# EasyEDA Pro project rk3568_xc7a100t.eprj, schematic rk3568, sheets 7 to 9 of 9

## Sheets
7 rk3568_board_peripheral: Create Date: 2024-08-02
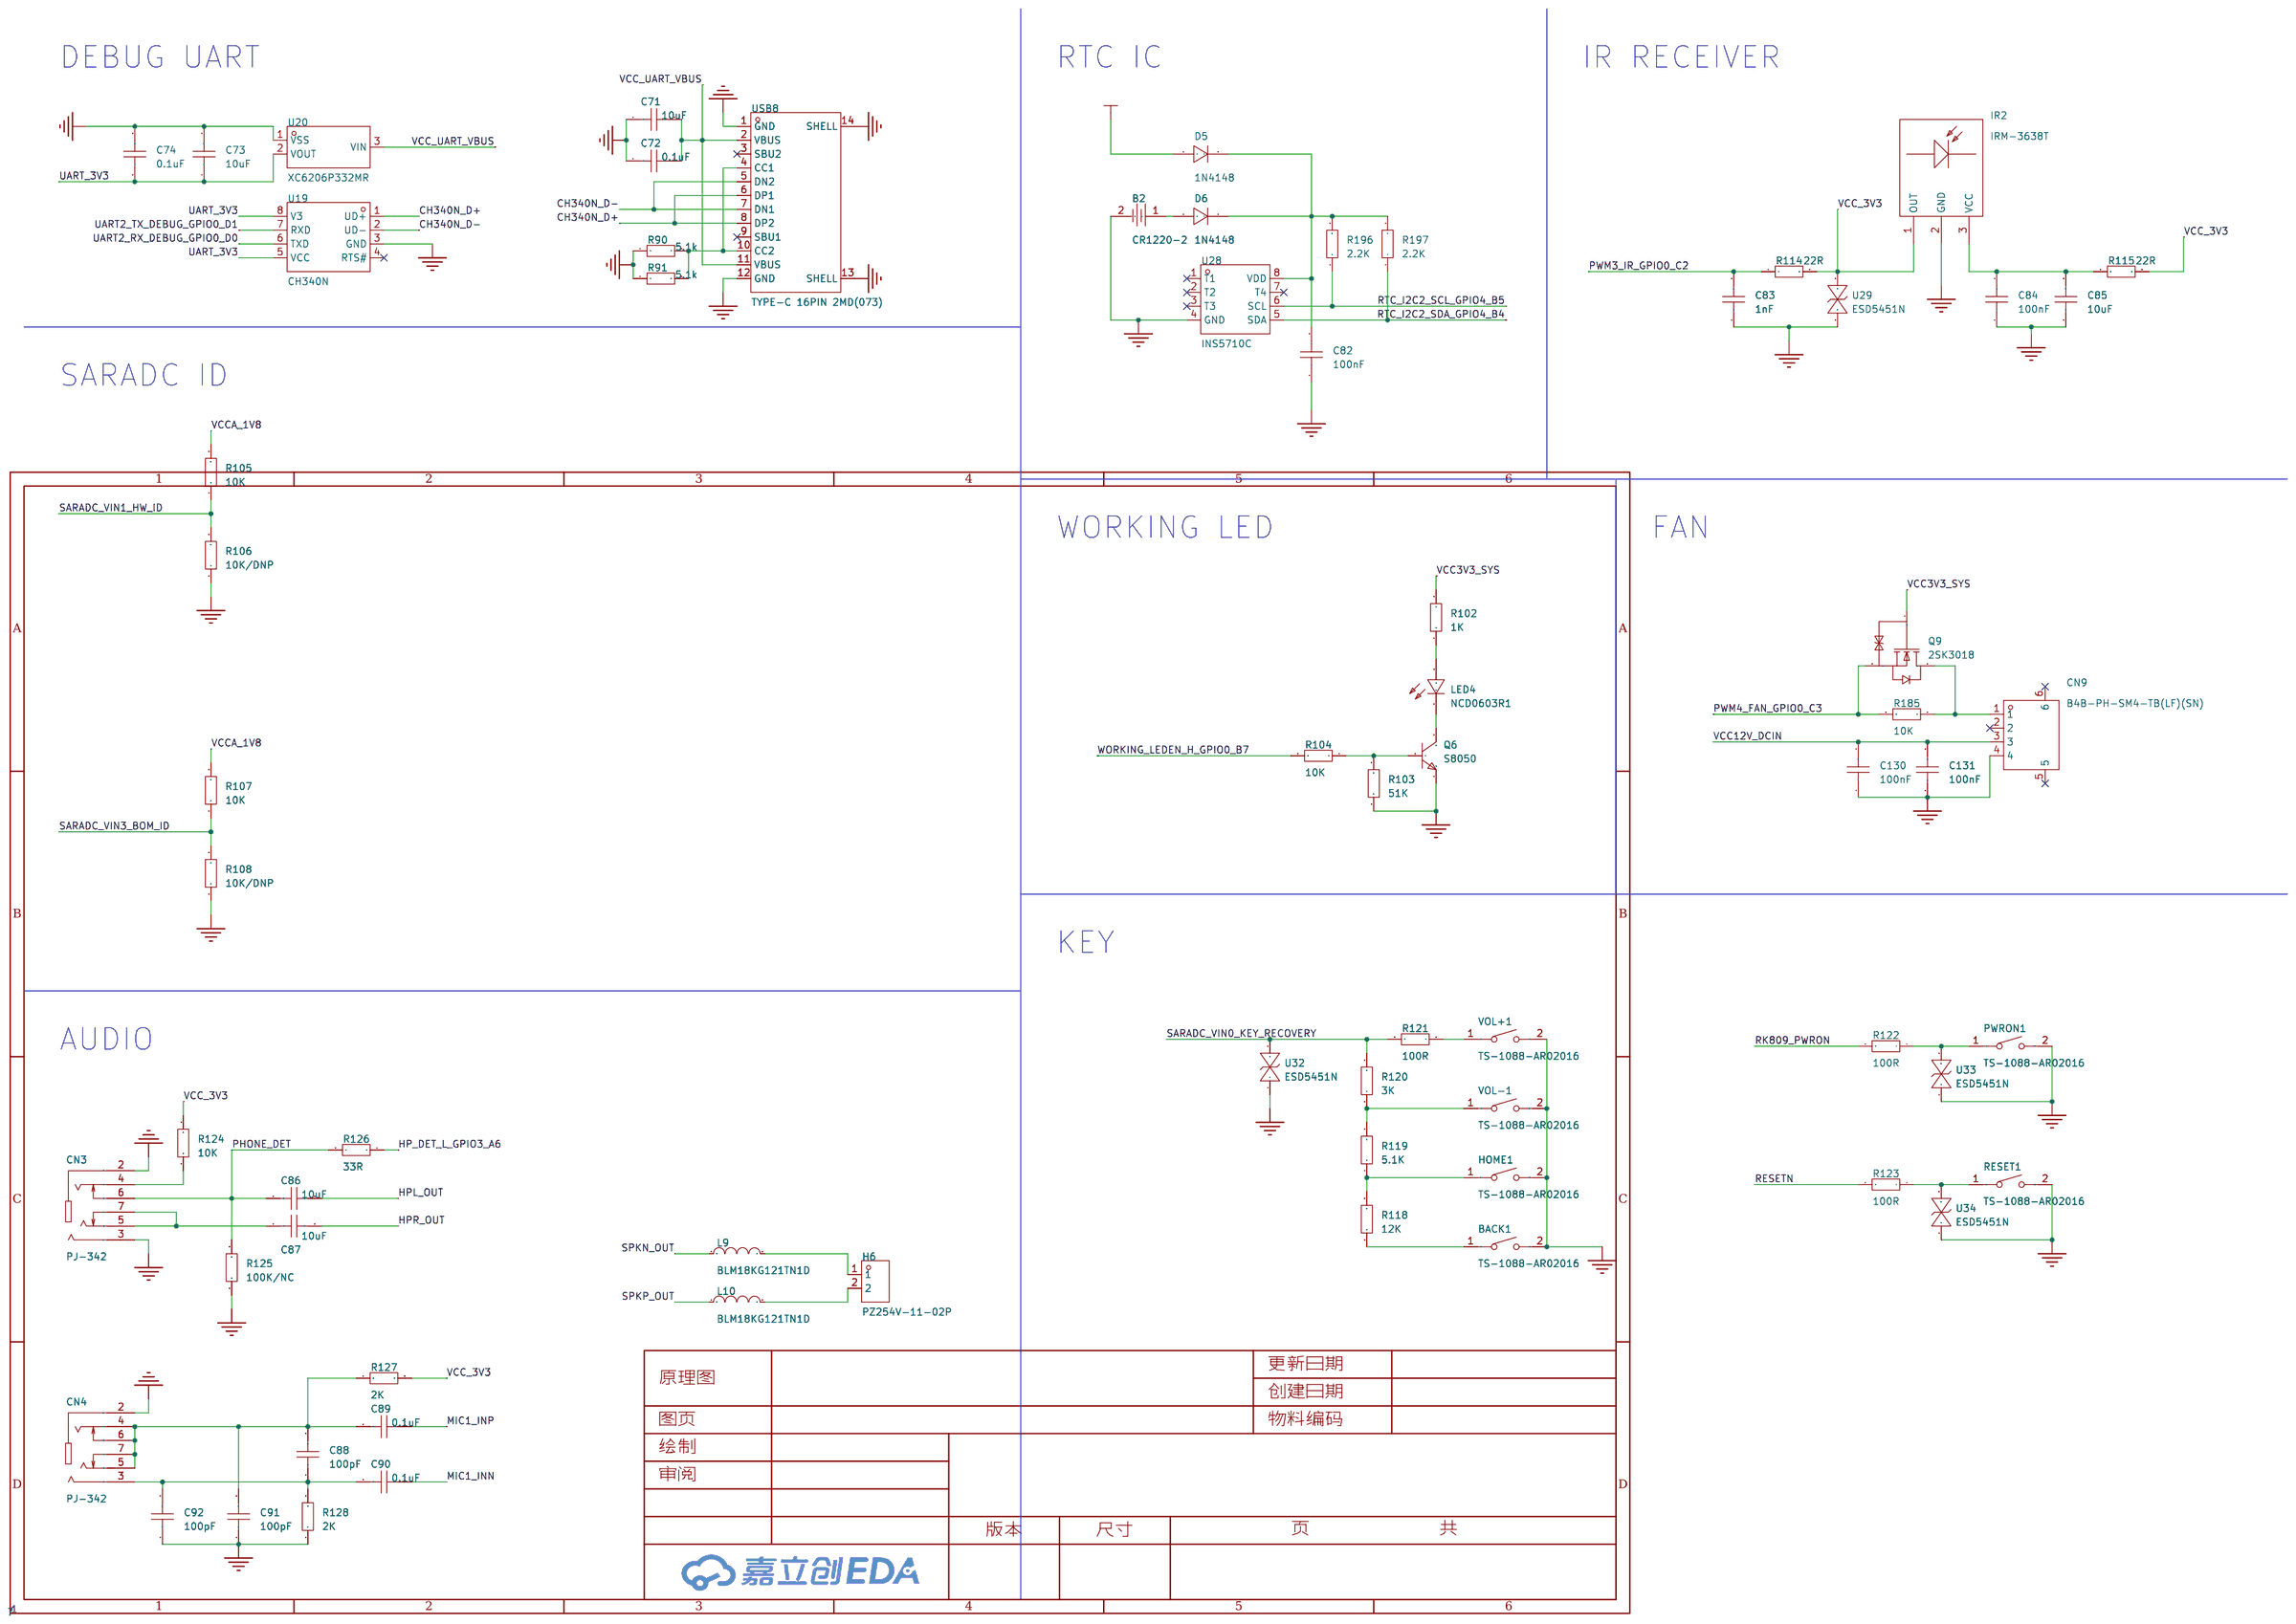
[diagram p6: rk3568_board_peripheral]
8 rk3568_user_interface: Create Date: 2024-08-02
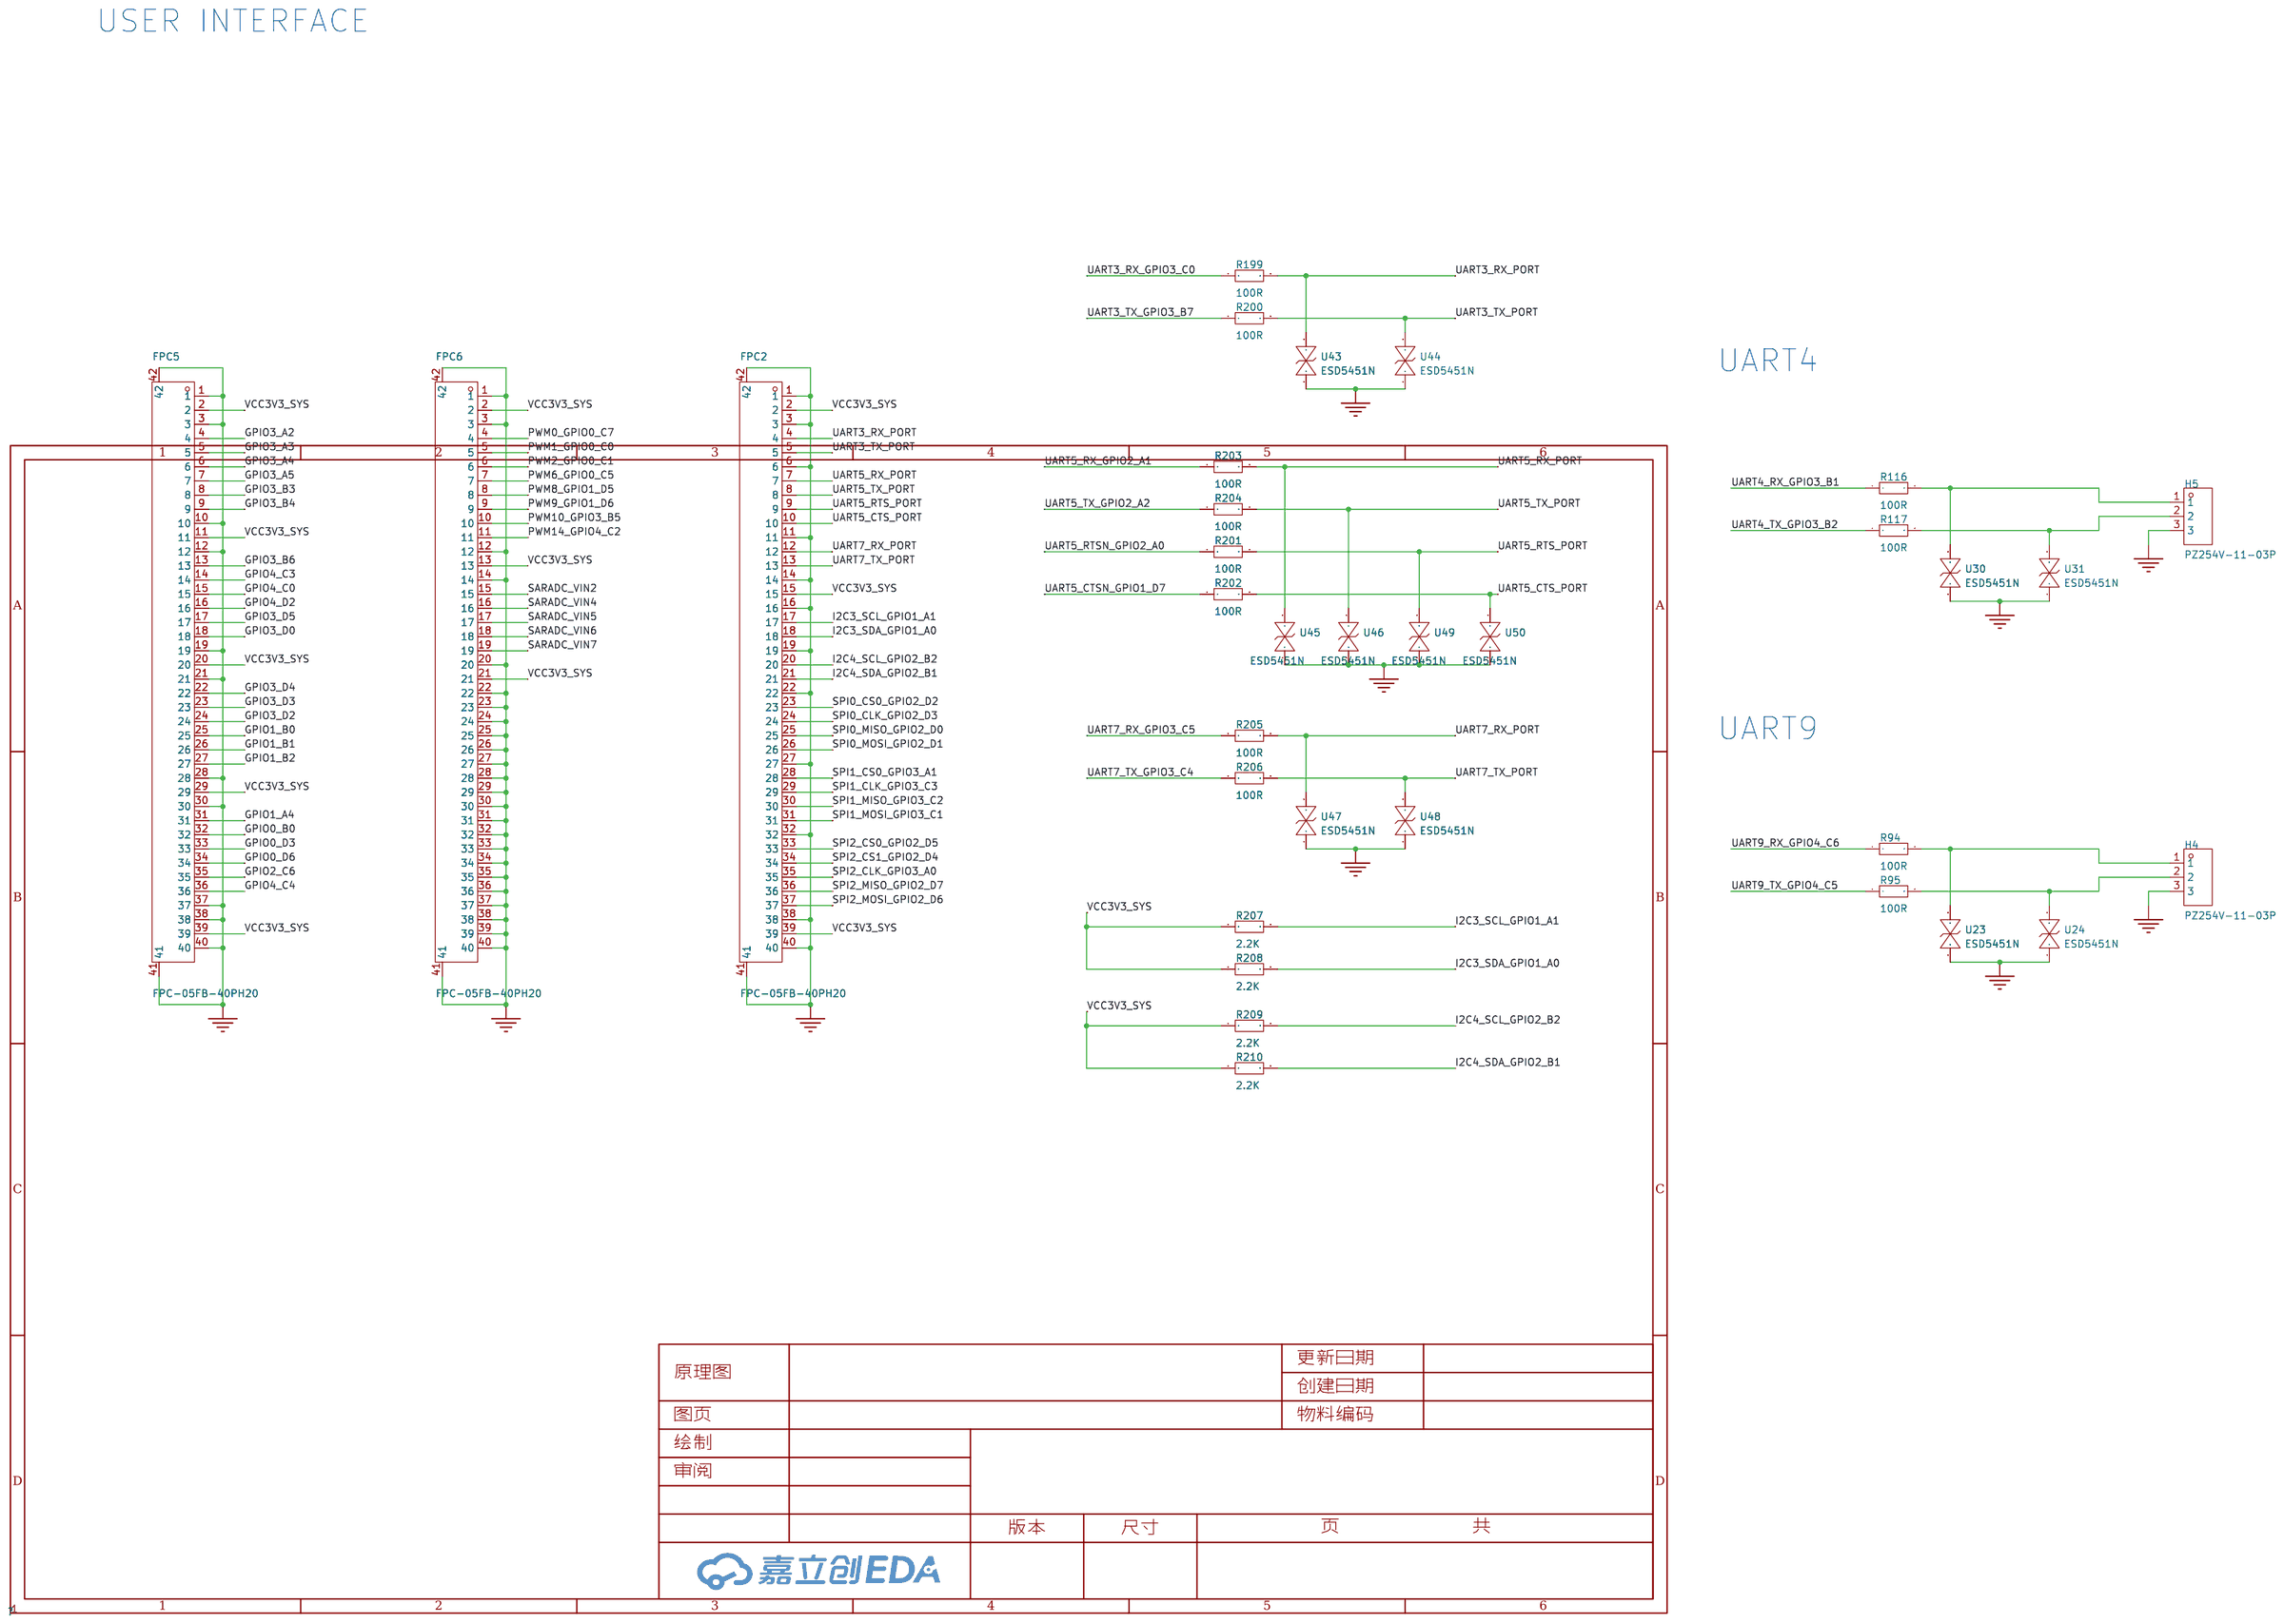
[diagram p7: rk3568_user_interface]
9 rk3568_pcie30x2_m2: Create Date: 2024-08-07
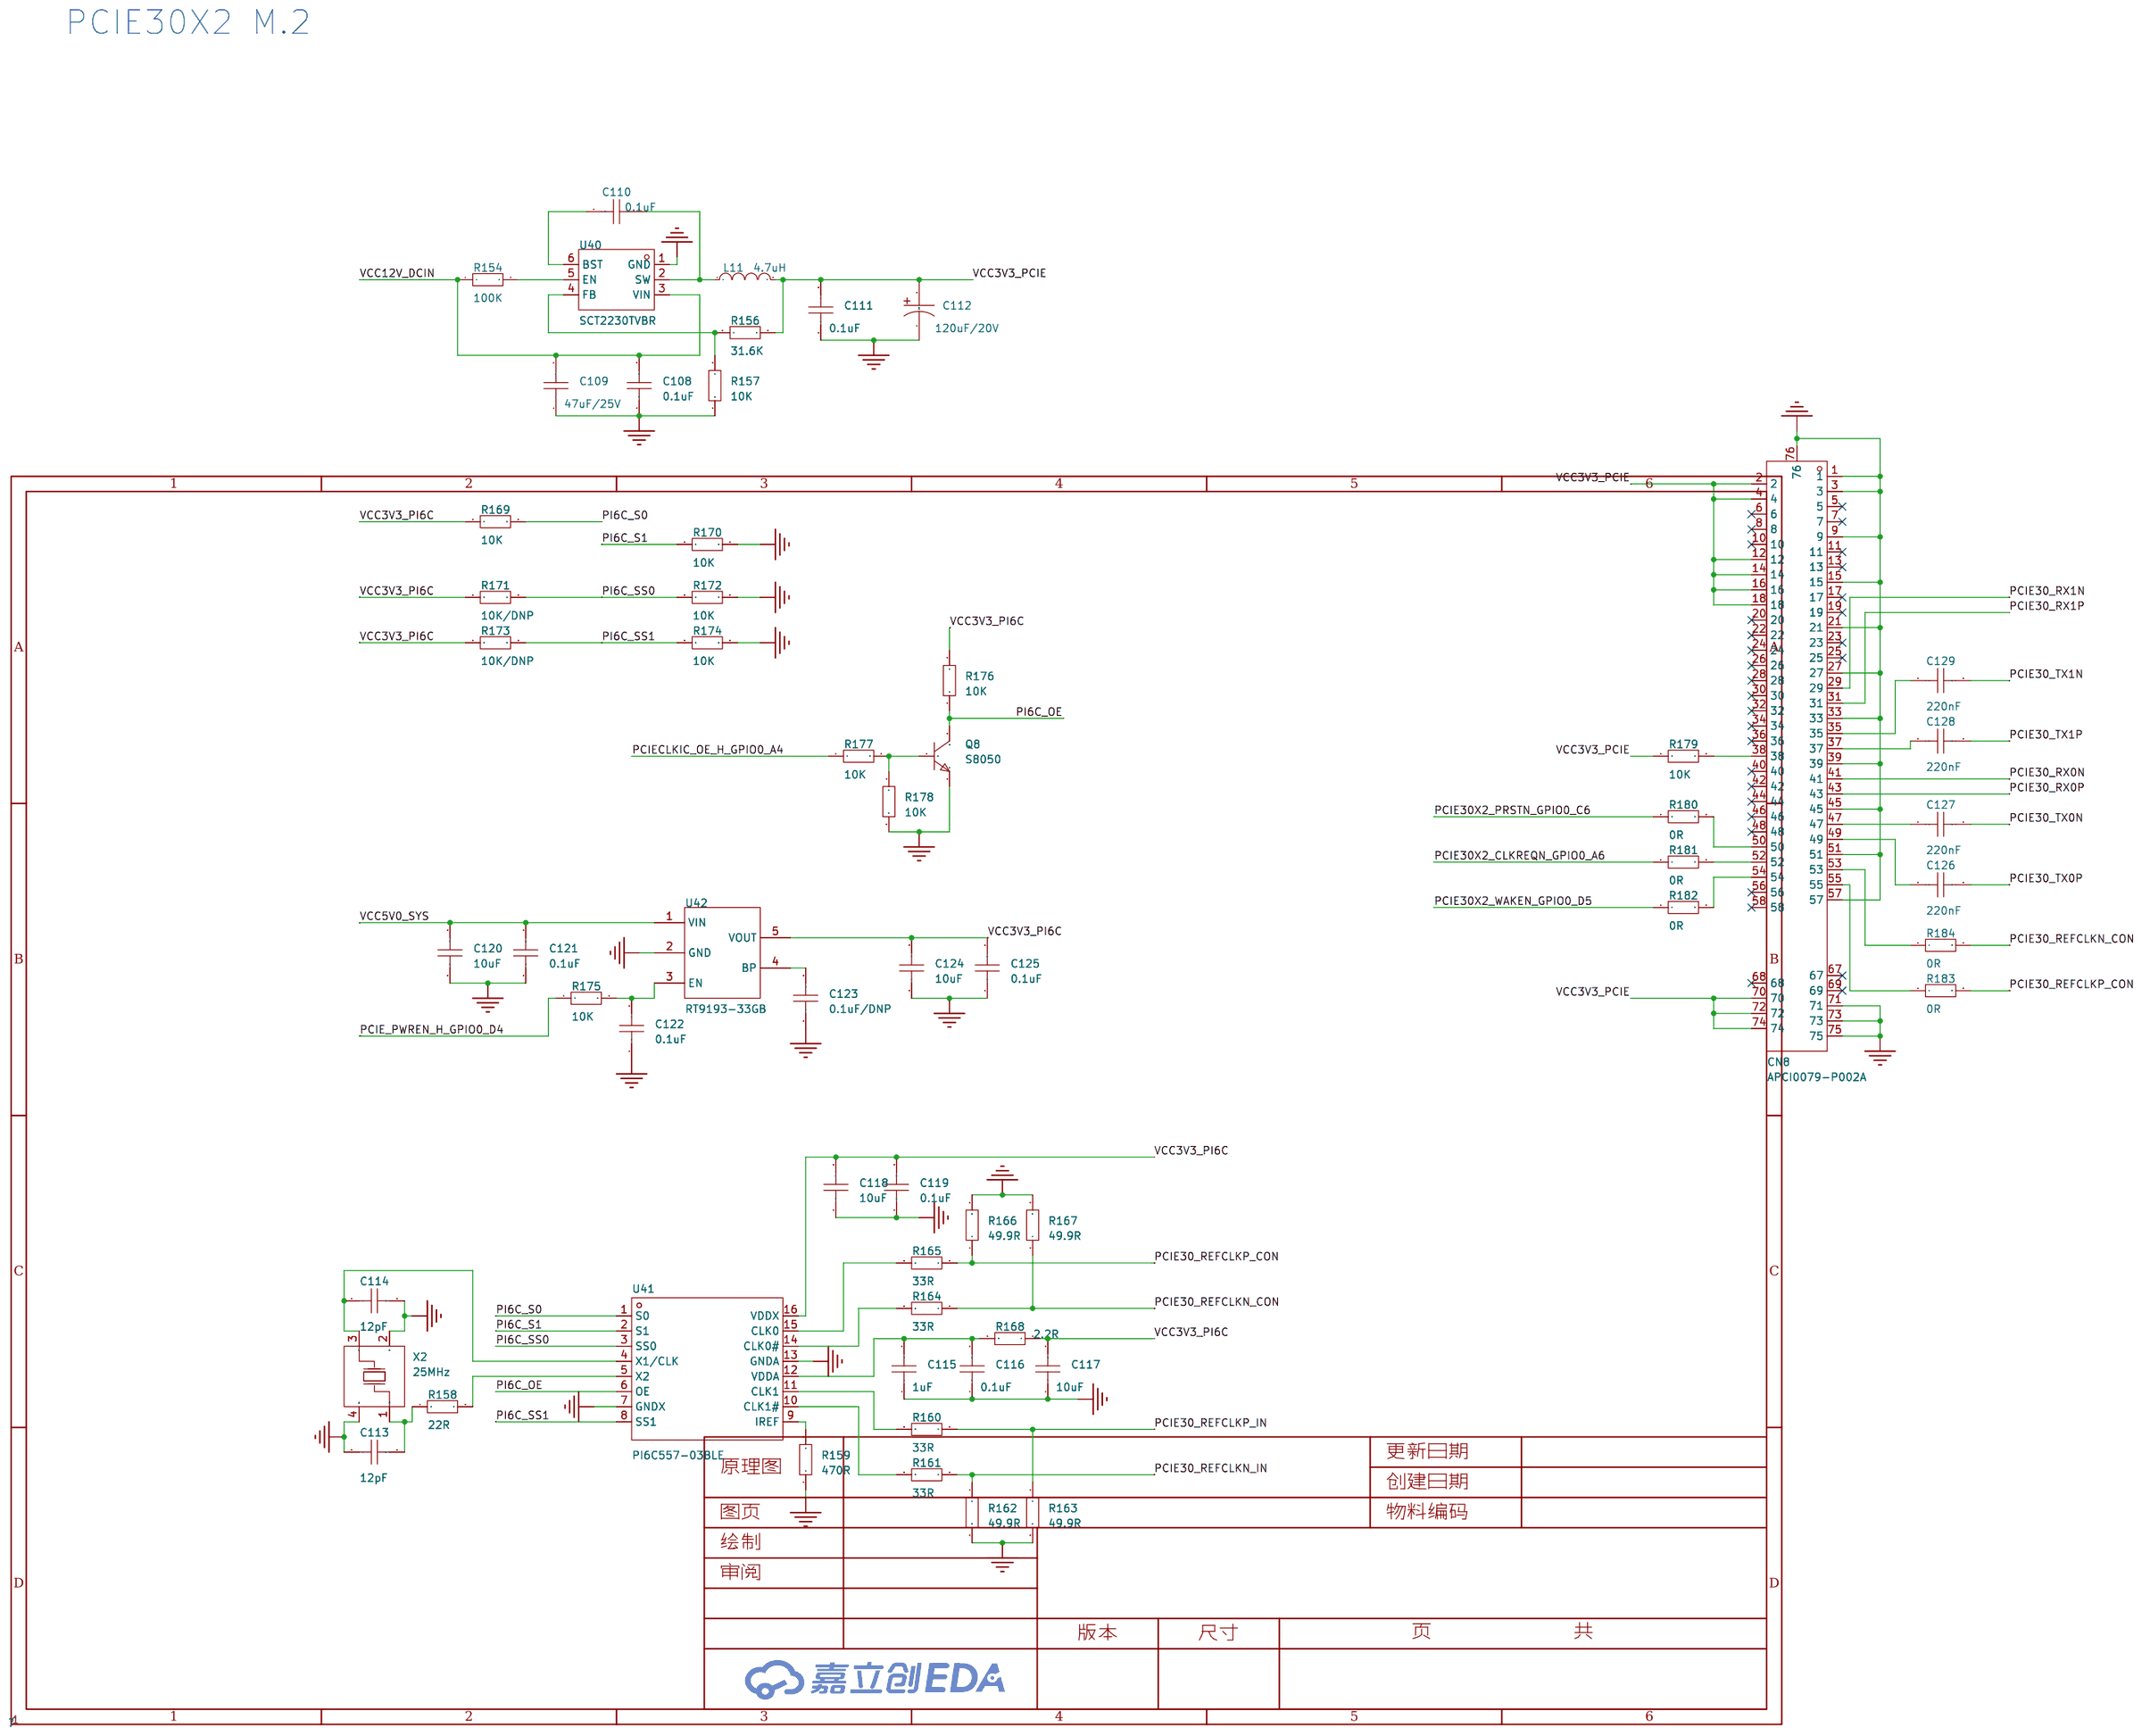
[diagram p8: rk3568_pcie30x2_m2]

## Parts
sheet rk3568_board_peripheral
B2  CR1220-2  [BAT-SMD_CR1220-2]
BACK1  TS-1088-AR02016  [SW-SMD_L3.9-W3.0-P4.45]
C71  10uF  [C0603]
C72  0.1uF  [C0603]
C73  10uF  [C0603]
C74  0.1uF  [C0603]
C82  100nF  [C0603]
C83  1nF  [C0603]
C84  100nF  [C0603]
C85  10uF  [C0603]
C86  10uF  [C0603]
C87  10uF  [C0603]
C88  100pF  [C0603]
C89  0.1uF  [C0603]
C90  0.1uF  [C0603]
C91  100pF  [C0603]
C92  100pF  [C0603]
C130  100nF  [C0603]
C131  100nF  [C0603]
CN3  PJ-342  [AUDIO-SMD_PJ-342]
CN4  PJ-342  [AUDIO-SMD_PJ-342]
CN9  B4B-PH-SM4-TB(LF)(SN)  [CONN-SMD_B4B-PH-SM4-TB-LF-SN]
D5  1N4148  [DO-35_BD2.0-L4.0-P8.00-D0.5-FD]
D6  1N4148  [DO-35_BD2.0-L4.0-P8.00-D0.5-FD]
H6  PZ254V-11-02P  [HDR-TH_2P-P2.54-V-M]
HOME1  TS-1088-AR02016  [SW-SMD_L3.9-W3.0-P4.45]
IR2  IRM-3638T  [OPTO-TH_IRM-3638T]
L9  BLM18KG121TN1D  [L0603]
L10  BLM18KG121TN1D  [L0603]
LED4  NCD0603R1  [LED0603-RD_RED]
PWRON1  TS-1088-AR02016  [SW-SMD_L3.9-W3.0-P4.45]
Q6  S8050  [SOT-23-3_L2.9-W1.6-P1.90-LS2.8-BR]
Q9  2SK3018  [SOT-323-3_L2.0-W1.3-P1.30-LS2.1-BR]
R90  5.1k  [R0603]
R91  5.1k  [R0603]
R102  1K  [R0603]
R103  51K  [R0603]
R104  10K  [R0603]
R105  10K  [R0603]
R106  10K/DNP  [R0603]
R107  10K  [R0603]
R108  10K/DNP  [R0603]
R114  22R  [R0603]
R115  22R  [R0603]
R118  12K  [R0603]
R119  5.1K  [R0603]
R120  3K  [R0603]
R121  100R  [R0603]
R122  100R  [R0603]
R123  100R  [R0603]
R124  10K  [R0603]
R125  100K/NC  [R0603]
R126  33R  [R0603]
R127  2K  [R0603]
R128  2K  [R0603]
R185  10K  [R0603]
R196  2.2K  [R0603]
R197  2.2K  [R0603]
RESET1  TS-1088-AR02016  [SW-SMD_L3.9-W3.0-P4.45]
U19  CH340N  [SOP-8_L4.9-W3.9-P1.27-LS6.0-BL]
U20  XC6206P332MR  [SOT-23-3_L3.0-W1.7-P0.95-LS2.9-BR]
U28  INS5710C  [SOP-8_L4.9-W3.9-P1.27-LS6.0-BL]
U29  ESD5451N  [X1-DFN1006-2_L1.0-W0.6-P0.65-BI]
U32  ESD5451N  [X1-DFN1006-2_L1.0-W0.6-P0.65-BI]
U33  ESD5451N  [X1-DFN1006-2_L1.0-W0.6-P0.65-BI]
U34  ESD5451N  [X1-DFN1006-2_L1.0-W0.6-P0.65-BI]
USB8  TYPE-C 16PIN 2MD(073)  [USB-C-SMD_TYPE-C-6PIN-2MD-073]
VOL+1  TS-1088-AR02016  [SW-SMD_L3.9-W3.0-P4.45]
VOL-1  TS-1088-AR02016  [SW-SMD_L3.9-W3.0-P4.45]
sheet rk3568_pcie30x2_m2
C108  0.1uF  [C0603]
C109  47uF/25V  [C0603]
C110  0.1uF  [C0603]
C111  0.1uF  [C0603]
C112  120uF/20V  [CAP-SMD_BD5.0-L5.3-W5.3-FD]
C113  12pF  [C0603]
C114  12pF  [C0603]
C115  1uF  [C0603]
C116  0.1uF  [C0603]
C117  10uF  [C0603]
C118  10uF  [C0603]
C119  0.1uF  [C0603]
C120  10uF  [C0603]
C121  0.1uF  [C0603]
C122  0.1uF  [C0603]
C123  0.1uF/DNP  [C0603]
C124  10uF  [C0603]
C125  0.1uF  [C0603]
C126  220nF  [C0603]
C127  220nF  [C0603]
C128  220nF  [C0603]
C129  220nF  [C0603]
CN8  APCI0079-P002A  [PCI-SMD_APCI0079-P002A]
L11  4.7uH  [L0603]
Q8  S8050  [SOT-23-3_L2.9-W1.3-P1.90-LS2.4-BR]
R154  100K  [R0603]
R156  31.6K  [R0603]
R157  10K  [R0603]
R158  22R  [R0603]
R159  470R  [R0603]
R160  33R  [R0603]
R161  33R  [R0603]
R162  49.9R  [R0603]
R163  49.9R  [R0603]
R164  33R  [R0603]
R165  33R  [R0603]
R166  49.9R  [R0603]
R167  49.9R  [R0603]
R168  2.2R  [R0603]
R169  10K  [R0603]
R170  10K  [R0603]
R171  10K/DNP  [R0603]
R172  10K  [R0603]
R173  10K/DNP  [R0603]
R174  10K  [R0603]
R175  10K  [R0603]
R176  10K  [R0603]
R177  10K  [R0603]
R178  10K  [R0603]
R179  10K  [R0603]
R180  0R  [R0603]
R181  0R  [R0603]
R182  0R  [R0603]
R183  0R  [R0603]
R184  0R  [R0603]
U40  SCT2230TVBR  [TSOT-23-6_L2.9-W1.6-P0.95-LS2.8-BL]
U41  PI6C557-03BLE  [TSSOP-16_L5.0-W4.4-P0.65-LS6.4-BL]
U42  RT9193-33GB  [SOT-23-5_L3.0-W1.7-P0.95-LS2.8-BL]
X2  25MHz  [OSC-SMD_4P-L3.2-W2.5-BL]
sheet rk3568_user_interface
FPC2  FPC-05FB-40PH20  [FPC-SMD_40P-P0.50_XUNPU_FPC-05FB-40PH20]
FPC5  FPC-05FB-40PH20  [FPC-SMD_40P-P0.50_XUNPU_FPC-05FB-40PH20]
FPC6  FPC-05FB-40PH20  [FPC-SMD_40P-P0.50_XUNPU_FPC-05FB-40PH20]
H4  PZ254V-11-03P  [HDR-TH_3P-P2.54-V-M]
H5  PZ254V-11-03P  [HDR-TH_3P-P2.54-V-M]
R94  100R  [R0603]
R95  100R  [R0603]
R116  100R  [R0603]
R117  100R  [R0603]
R199  100R  [R0603]
R200  100R  [R0603]
R201  100R  [R0603]
R202  100R  [R0603]
R203  100R  [R0603]
R204  100R  [R0603]
R205  100R  [R0603]
R206  100R  [R0603]
R207  2.2K  [R0603]
R208  2.2K  [R0603]
R209  2.2K  [R0603]
R210  2.2K  [R0603]
U23  ESD5451N  [X1-DFN1006-2_L1.0-W0.6-P0.65-BI]
U24  ESD5451N  [X1-DFN1006-2_L1.0-W0.6-P0.65-BI]
U30  ESD5451N  [X1-DFN1006-2_L1.0-W0.6-P0.65-BI]
U31  ESD5451N  [X1-DFN1006-2_L1.0-W0.6-P0.65-BI]
U43  ESD5451N  [X1-DFN1006-2_L1.0-W0.6-P0.65-BI]
U44  ESD5451N  [X1-DFN1006-2_L1.0-W0.6-P0.65-BI]
U45  ESD5451N  [X1-DFN1006-2_L1.0-W0.6-P0.65-BI]
U46  ESD5451N  [X1-DFN1006-2_L1.0-W0.6-P0.65-BI]
U47  ESD5451N  [X1-DFN1006-2_L1.0-W0.6-P0.65-BI]
U48  ESD5451N  [X1-DFN1006-2_L1.0-W0.6-P0.65-BI]
U49  ESD5451N  [X1-DFN1006-2_L1.0-W0.6-P0.65-BI]
U50  ESD5451N  [X1-DFN1006-2_L1.0-W0.6-P0.65-BI]

## Library data of the parts
B2 = CR1220-2: LCSC Part Name: 电池底座 适用电池:CR1220; Supplier Part: C70381; Manufacturer: Q&J; Supplier Footprint: SMD; JLCPCB Part Class: 扩展库; Datasheet: https://atta.szlcsc.com/upload/public/pdf/source/20160427/1461725216696.pdf; Supplier: LCSC; Connector Type: 电池底座; Battery Type: CR1220
BACK1 HOME1 PWRON1 RESET1 VOL+1 VOL-1 = TS-1088-AR02016: LCSC Part Name: 4*3*2mm 立贴 轻触开关; Supplier Part: C720477; Manufacturer: XUNPU(讯普); Supplier Footprint: SMD; JLCPCB Part Class: 扩展库; Datasheet: https://atta.szlcsc.com/upload/public/pdf/source/20200810/C720475_60D09DD6C54279ADDB2DC25100F1CC11.pdf; Supplier: LCSC; Circuit: 单刀单掷; Actuator Style: 圆形按钮; Operating Force: 160gf; Mounting Style: 立贴; Switch Length: 4mm; Switch Width: 3mm; Switch Height: 2mm; Strike Gundam: 不带; Contact Current: 50mA; Voltage Rating (DC): 12V; Insulation Resistance: 100MΩ; Actuator/Cap Color: 黑色; Pin Style: SMD接片; Mechanical Life: 10万次; Operating Temperature: -30℃~+80℃
C71-C74 C82-C92 C108-C111 C113-C131 = CAP_0603: Supplier Footprint: 0603
CN3 CN4 = PJ-342_C668606: LCSC Part Name: 3.5mm耳机座; Supplier Part: C668606; Manufacturer: SHOU HAN(首韩); Supplier Footprint: SMD; JLCPCB Part Class: 扩展库; Datasheet: https://atta.szlcsc.com/upload/public/pdf/source/20200618/C668606_D9051A7D9D1D8CCDEAA76A8E7BC279ED.pdf; Supplier: LCSC; Connector Type: 3.5mm耳机座; Current Rating (Max): 500mA; Voltage Rating (Max): 30V; Operating Temperature Range: -30℃~+70℃
CN9 = B4B-PH-SM4-TB(LF)(SN): LCSC Part Name: 1x4P 间距:2mm 立贴 系列:PH; Supplier Part: C160354; Manufacturer: JST; Supplier Footprint: SMD,P=2mm; JLCPCB Part Class: 扩展库; Datasheet: https://atta.szlcsc.com/upload/public/pdf/source/20181010/C265101_22107ACC4D8714694FDA2DD97145FA81.pdf; Supplier: LCSC; Pins Structure: 1x4P; Pitch: 2mm; Mounting Style: 立贴; Reference Series: PH; Number of Pins: 4P; Number of Rows: 1; Number of PINs Per Row: 4; Current Rating (Max): 2A; Contact Material: 铜合金; Contact Plating: 锡; Operating Temperature Range: -25℃~+85℃; Rated Voltage (Max): 100V; Plastic Material: PA; Flame Retardant Rating: UL94V-0; Supplementary Features: 辅助焊脚; Colour: 米色; Z-Height of the Board: 6.6mm; X-Length of Bottom Edge on Board (Spacing Line): 11.95mm; Y-Width of Bottom Edge on Board: 7mm
D5 D6 = 1N4148_C258182: LCSC Part Name: 电压:100V 电流:200mA; Supplier Part: C258182; Manufacturer: onsemi(安森美); Supplier Footprint: DO-35; JLCPCB Part Class: 扩展库; Datasheet: https://atta.szlcsc.com/upload/public/pdf/source/20180829/C258182_3EE2D0AB6109C1B72B054FC50B8BC8AD.pdf; Supplier: LCSC; Forward Voltage (Vf@If): 1V@10mA; Reverse Voltage (Vr): 100V; Average Rectified Current (Io): 200mA; Reverse Leakage Current: 5uA@75V; Reverse Recovery Time (trr): 4ns; Operating Temperature: -55℃~+175℃@(Tj)
H6 = PZ254V-11-02P: LCSC Part Name: 间距:2.54mm 1x2P 直插 方针; Supplier Part: C492401; Manufacturer: XFCN(兴飞); Supplier Footprint: 插件,P=2.54mm; JLCPCB Part Class: 扩展库; Datasheet: https://atta.szlcsc.com/upload/public/pdf/source/20200309/C492401_A812433581A9B211A7FFA413ADDFF0E5.pdf; Supplier: LCSC; Pin Structure: 1x2P; Pitch: 2.54mm; Circluar Pins/Square Pins: 方针; Mounting Type: 直插; Number of Rows: 单排; Number of Pins: 2P; Length of Mating Pin: 6mm; Insulation Height: 2.5mm; Length of End Connection Pin: 3mm; Contact Material: 黄铜; Operating Temperature Range: -40℃~+105℃; Color: 黑色
IR2 = IRM-3638T: LCSC Part Name: 接收距离6m ±35°@水平 ±35°@垂直; Supplier Part: C16216; Manufacturer: EVERLIGHT(亿光); Supplier Footprint: SIP-3-2.54mm; JLCPCB Part Class: 扩展库; Datasheet: https://atta.szlcsc.com/upload/public/pdf/source/20220214/1DCBCED37080C09F6BD0084BAB4DFEE5.pdf; Supplier: LCSC; Supply Voltage: 2.7V~5.5V; Supply Current: 450uA; Transmission Distance: 6m; Center Frequency: 38kHz; Half Angle: ±35°@垂直；±35°@水平; Operating Temperature: -20℃~+80℃
L9 L10 = BLM18KG121TN1D: LCSC Part Name: 单路 0603磁珠 阻抗120Ω@100MHz; Supplier Part: C85831; Manufacturer: muRata(村田); Supplier Footprint: 0603; JLCPCB Part Class: 扩展库; Datasheet: https://atta.szlcsc.com/upload/public/pdf/source/20180329/C160981_FD3C2D2622A377E203B89F4AA32B0741.pdf; Supplier: LCSC; Impedance @ Frequency: 120Ω@100MHz; Tolerance: ±25%; DC Resistance: 30mΩ; Current Rating: 3A; Circuits: 1
LED4 = NCD0603R1_C84263: Supplier Part: C84263; Manufacturer: 国星光电; Supplier Footprint: 0603; JLCPCB Part Class: 扩展库; Datasheet: https://atta.szlcsc.com/upload/public/pdf/source/20200820/C84263_DABC6A75E58F576973B407FDBA283D60.pdf; Supplier: LCSC; Emitted Color: 红色; Forward Voltage (VF): 1.6V~2.6V; Power Dissipation: 65mW; Forward Current: 20mA; Dominant Wavelength: 615nm~630nm; Diode Configuration: 独立二极管; Lens Color: 无色透明透镜; Luminous Intensity: 80mcd~220mcd; Viewing Angle: 130°; Operating Temperature: -30℃~+85℃
Q6 = S8050_C181158: LCSC Part Name: NPN 电流:500mA 耐压:25V; Supplier Part: C181158; Manufacturer: Hottech(合科泰); Supplier Footprint: SOT-23; JLCPCB Part Class: 扩展库; Datasheet: https://atta.szlcsc.com/upload/public/pdf/source/20220506/D987F39D56F2975D34EC7947E75C4ABC.pdf; Supplier: LCSC; Transistor Type: NPN; Collector Current (Ic): 500mA; Collector-Emitter Breakdown Voltage (Vceo): 25V; Power Dissipation (Pd): 300mW; Transition Frequency (fT): 150MHz; Collector Cut-Off Current (Icbo): 100nA; Collector-Emitter Saturation Voltage (VCE(sat)@Ic,Ib): 600mV@500mA,50mA
Q9 = 2SK3018_C194460: LCSC Part Name: N沟道 耐压:30V 电流:100mA; Supplier Part: C194460; Manufacturer: CJ(江苏长电/长晶); Supplier Footprint: SOT-323-3; JLCPCB Part Class: 扩展库; Datasheet: https://atta.szlcsc.com/upload/public/pdf/source/20180612/C194460_7DCC01674DB4E554C67F4CC0517F82F1.pdf; Supplier: LCSC; Type: N沟道; Drain Source Voltage (Vdss): 30V; Continuous Drain Current (Id): 100mA; Power Dissipation (Pd): 200mW; Drain Source On Resistance (RDS(on)@Vgs,Id): 8Ω@4V,10mA; Gate Threshold Voltage (Vgs(th)@Id): 1.5V; Input Capacitance (Ciss@Vds): 13pF; Reverse Transfer Capacitance (Crss@Vds): 4pF
R90 R91 R94 R95 R102-R108 R114-R128 R154 R156-R185 R196 R197 R199-R210 = Res_0603: Supplier Footprint: 0603
U19 = CH340N: LCSC Part Name: USB转串口芯片 CH340; Supplier Part: C2977777; Manufacturer: WCH(南京沁恒); Supplier Footprint: SOP-8; JLCPCB Part Class: 扩展库; Datasheet: https://atta.szlcsc.com/upload/public/pdf/source/20230530/6E401E9554E9F5311886CC8B3F89B62E.pdf; Supplier: LCSC
U20 = XC6206P332MR_C347376: LCSC Part Name: 输入8V 输出3.3V 250mA; Supplier Part: C347376; Manufacturer: UMW(友台半导体); Supplier Footprint: SOT-23; JLCPCB Part Class: 扩展库; Datasheet: https://atta.szlcsc.com/upload/public/pdf/source/20231109/6B10DA60E52FC900BF97E3EFEB5D6341.pdf; Supplier: LCSC; Output Type: 固定; Maximum Input Voltage: 8V; Output Voltage: 3.3V; MAX Output Current: 250mA; Power Supply Rejection Ratio (PSRR): 40dB@(1kHz); Dropout Voltage: 240mV@(50mA); Operating Temperature: -25℃~+80℃; Output Polarity: 正极; Number of Outputs: 1
U28 = INS5710C: Supplier Part: C7503000; Manufacturer: DAPU(大普通信); Supplier Footprint: SOP8; JLCPCB Part Class: 扩展库; Supplier: LCSC; Interface: I2C; Operating Voltage: 1.6V~5.5V; crystal oscillator: 内置; Operating Temperature: -40℃~+85℃
U23 U24 U29-U34 U43-U50 = ESD5451N_C2936977: LCSC Part Name: ESD二极管; Supplier Part: C2936977; Manufacturer: TECH PUBLIC(台舟); Supplier Footprint: DFN1006-2; JLCPCB Part Class: 扩展库; Datasheet: https://atta.szlcsc.com/upload/public/pdf/source/20211227/D040CF3F0222548C5BD9F7E690946783.pdf; Supplier: LCSC
USB8 = TYPE-C 16PIN 2MD(073): LCSC Part Name: Type-C 母 卧贴; Supplier Part: C2765186; Manufacturer: SHOU HAN(首韩); Supplier Footprint: SMD; JLCPCB Part Class: 扩展库; Datasheet: https://atta.szlcsc.com/upload/public/pdf/source/20211123/39B17C16241EAC15C5E277BDA434118E.pdf; Supplier: LCSC; Connector Type: Type-C; Gender: 母; Number of Ports: 1; Number of Contacts: 16P; Mounting Style: 卧贴; Current Rating - Power (Max): 5A; Operating Temperature Range: -25℃~+85℃
C112 = EEEFK1A121SR: LCSC Part Name: 120uF ±20% 10V; Supplier Part: C336771; Manufacturer: PANASONIC(松下); Supplier Footprint: SMD,D5xL5.8mm; JLCPCB Part Class: 扩展库; Datasheet: https://atta.szlcsc.com/upload/public/pdf/source/20190312/C336771_94305295C619F3AA9AF4DC9402685E39.pdf; Supplier: LCSC; Tolerance: ±20%; Rated Voltage: 10V; Ripple Current: 160mA@100kHz; Equivalent Series Resistance(ESR): 700mΩ@100kHz; φD: 5mm; L: 6.1mm; Lifetime @ Temp: 2000hrs@105℃; Operating Temperature: -55℃~+105℃
CN8 = APCI0079-P002A: LCSC Part Name: 0.5mm P数:67P; Supplier Part: C841651; Manufacturer: LOTES(嘉澤端子); Supplier Footprint: SMD,P=0.5mm,卧贴; JLCPCB Part Class: 扩展库; Datasheet: https://atta.szlcsc.com/upload/public/pdf/source/20201123/C841651_278250E0EADC3D3046329CEFDE3DD0BE.pdf; Supplier: LCSC; Connector Type: M.2; Pitch: 0.5mm; Number of Pins: 67P; Mounting Style: 卧贴; Height Above Board: 3.2mm
L11 = L_0603
Q8 = S8050_C2891804: LCSC Part Name: NPN 电流:500mA 耐压:25V; Supplier Part: C2891804; Manufacturer: YONGYUTAI(永裕泰); Supplier Footprint: SOT-23; JLCPCB Part Class: 扩展库; Datasheet: https://atta.szlcsc.com/upload/public/pdf/source/20210901/5347316A10609C628D4D69AE01446E5B.pdf; Supplier: LCSC; Transistor Type: NPN; Collector Current (Ic): 500mA; Collector-Emitter Breakdown Voltage (Vceo): 25V; Power Dissipation (Pd): 300mW; Collector Cut-Off Current (Icbo): 1uA; Collector-Emitter Saturation Voltage (VCE(sat)@Ic,Ib): 500mV@500mA,50mA
U40 = SCT2230TVBR: Supplier Part: C719318; Manufacturer: SCT(芯洲科技); Supplier Footprint: TSOT-23-6L; JLCPCB Part Class: 扩展库; Datasheet: https://atta.szlcsc.com/upload/public/pdf/source/20200810/C719318_3BA2FB8EAD34919658A915398BC1C87F.pdf; Supplier: LCSC
U41 = PI6C557-03BLE: Supplier Part: C150743; Manufacturer: DIODES(美台); Supplier Footprint: TSSOP-16; JLCPCB Part Class: 扩展库; Datasheet: https://atta.szlcsc.com/upload/public/pdf/source/20220205/C2667752_8DDD9CC345BCE40D63D60BED135283E9.pdf; Supplier: LCSC; Output Frequency (Max): 200MHz; Supply Voltage: 3V~3.6V; Operating Temperatue: -40℃~+85℃
U42 = RT9193-33GB: LCSC Part Name: 输入5.5V 输出3.3V 300mA; Supplier Part: C15651; Manufacturer: RICHTEK(立锜); Supplier Footprint: SOT-23-5; JLCPCB Part Class: 扩展库; Datasheet: https://atta.szlcsc.com/upload/public/pdf/source/20130730/1457706628575.pdf; Supplier: LCSC; Output Type: 固定; Maximum Input Voltage: 5.5V; Output Voltage: 3.3V; MAX Output Current: 300mA; Power Supply Rejection Ratio (PSRR): 70dB; Dropout Voltage: 300mV@(300mA); standby current: 130uA; Operating Temperature: -40℃~+125℃; Output Polarity: 正极; Number of Outputs: 1
X2 = X322525MOB4SI: LCSC Part Name: 25MHz ±10ppm 12pF; Supplier Part: C9006; Manufacturer: YXC(扬兴晶振); Supplier Footprint: SMD3225-4P; JLCPCB Part Class: 基础库; Datasheet: https://atta.szlcsc.com/upload/public/pdf/source/20240329/19D5F850207469550BEB00D7DFEDBC7A.pdf; Supplier: LCSC; Crystal Type: 贴片晶振; Normal temperature Frequency Tolerance: ±10ppm; External load capacitor: 12pF; Frequency Stability(Full temperature range): ±20ppm; Operating Temperature: -40℃~+85℃
FPC2 FPC5 FPC6 = FPC-05FB-40PH20: LCSC Part Name: 间距:0.5mm P数:40P 翻盖式 双侧触点/上下接; Supplier Part: C2856837; Manufacturer: XUNPU(讯普); Supplier Footprint: SMD,P=0.5mm,卧贴; JLCPCB Part Class: 扩展库; Datasheet: https://atta.szlcsc.com/upload/public/pdf/source/20210922/C2856837_A0FF02895414764A7F2E525E58748FC4.pdf; Supplier: LCSC; Locking Feature: 翻盖式; Contact Type: 双侧触点/上下接; Number of Contacts: 40P; Pitch: 0.5mm; Mounting Type: 卧贴; FFC, FCB Thickness: 0.3mm; Height Above Board: 2mm; Operating Temperature Range: -25℃~+85℃
H4 H5 = PZ254V-11-03P: LCSC Part Name: 间距:2.54mm 1x3P 直插 方针; Supplier Part: C2937625; Manufacturer: XFCN(兴飞); Supplier Footprint: 插件,P=2.54mm; JLCPCB Part Class: 扩展库; Datasheet: https://atta.szlcsc.com/upload/public/pdf/source/20200309/C492402_8335C3D49C4E4C618838D59BB1D024C1.pdf; Supplier: LCSC; Pin Structure: 1x3P; Pitch: 2.54mm; Circluar Pins/Square Pins: 方针; Mounting Type: 直插; Number of Rows: 单排; Number of Pins: 3P; Current Rating (Max): 3A; Voltage Rating (Max): 250V; Length of Mating Pin: 6mm; Insulation Height: 2.5mm; Length of End Connection Pin: 3mm; Operating Temperature Range: -40℃~+105℃; Color: 黑色

## Nets
GND: B2.2 BACK1.2 C71.1 C72.1 C73.2 C74.2 C82.1 C83.1 C84.1 C85.1 C91.1 C92.1 C108.1 C109.1 C111.1 C112.2 C113.1 C114.2 C115.1 C116.1 C117.1 C118.1 C119.1 C120.1 C121.1 C122.1 C123.1 C124.1 C125.1 C130.1 C131.1 CN3.2 CN3.3 CN4.2 CN8.1 CN8.3 CN8.9 CN8.15 CN8.21 CN8.27 CN8.33 CN8.39 CN8.45 CN8.51 CN8.57 CN8.71 CN8.73 CN8.75 CN8.76 CN9.4 FPC2.1 FPC2.3 FPC2.6 FPC2.11 FPC2.14 FPC2.16 FPC2.19 FPC2.22 FPC2.27 FPC2.32 FPC2.38 FPC2.40 FPC2.41 FPC2.42 FPC5.1 FPC5.3 FPC5.10 FPC5.12 FPC5.19 FPC5.21 FPC5.28 FPC5.30 FPC5.37 FPC5.38 FPC5.40 FPC5.41 FPC5.42 FPC6.1 FPC6.3 FPC6.12 FPC6.14 FPC6.20 FPC6.22 FPC6.23 FPC6.24 FPC6.25 FPC6.26 FPC6.27 FPC6.28 FPC6.29 FPC6.30 FPC6.31 FPC6.32 FPC6.33 FPC6.34 FPC6.35 FPC6.36 FPC6.37 FPC6.38 FPC6.39 FPC6.40 FPC6.41 FPC6.42 H4.3 H5.3 HOME1.2 IR2.2(GND) PWRON1.2 Q6.2 Q8.2(E) R90.1 R91.1 R103.1 R106.1 R108.1 R125.1 R128.1 R157.1 R159.1 R162.2 R163.2 R166.2 R167.2 R170.2 R172.2 R174.2 R178.2 RESET1.2 U19.3(GND) U20.1(VSS) U23.1 U24.1 U28.4(GND) U29.1 U30.1 U31.1 U32.1 U33.1 U34.1 U40.1(GND) U41.7(GNDX) U41.13(GNDA) U42.2(GND) U43.1 U44.1 U45.1 U46.1 U47.1 U48.1 U49.1 U50.1 USB8.1(GND) USB8.12(GND) USB8.13(SHELL) USB8.14(SHELL) VOL+1.2 VOL-1.2 X2.2(GND) X2.4(GND) ; also on sheet 1 2 3 4 5 6
VCC3V3_PCIE: C111.2 C112.1 CN8.2 CN8.4 CN8.12 CN8.14 CN8.16 CN8.18 CN8.70 CN8.72 CN8.74 L11.2 R156.2 R179.1
VCC3V3_PI6C: C117.2 C118.2 C119.2 C124.2 C125.2 R168.1 R169.1 R171.1 R173.1 R176.2 U41.16(VDDX) U42.5(VOUT)
VCC3V3_SYS: D5.1(A) FPC2.2 FPC2.15 FPC2.39 FPC5.2 FPC5.11 FPC5.20 FPC5.29 FPC5.39 FPC6.2 FPC6.13 FPC6.21 IR2.1(OUT) Q9.1(G) R102.2 R114.2 R115.2 R124.2 R127.2 R207.1 R208.1 R209.1 R210.1 U29.2 ; also on sheet 1 2 4 5 6
VCC5V0_SYS: C120.2 C121.2 U42.1(VIN) ; also on sheet 1 2 3 4
VCC12V_DCIN: C108.2 C109.2 C130.2 C131.2 CN9.3 R154.1 U40.3(VIN) ; also on sheet 2
VCC_UART_VBUS: C71.2 C72.2 U20.3(VIN) USB8.2(VBUS) USB8.11(VBUS)
VCCA_1V8: R105.2 R107.2
CH340N_D+: U19.1(UD+) USB8.6(DP1) USB8.8(DP2)
CH340N_D-: U19.2(UD-) USB8.5(DN2) USB8.7(DN1)
GPIO0_B0: FPC5.32 ; also on sheet 1
GPIO0_D3: FPC5.33 ; also on sheet 1
GPIO0_D6: FPC5.34 ; also on sheet 1
GPIO1_A4: FPC5.31 ; also on sheet 1
GPIO1_B0: FPC5.25 ; also on sheet 1
GPIO1_B1: FPC5.26 ; also on sheet 1
GPIO1_B2: FPC5.27 ; also on sheet 1
GPIO2_C6: FPC5.35 ; also on sheet 1
GPIO3_A2: FPC5.4 ; also on sheet 1
GPIO3_A3: FPC5.5 ; also on sheet 1
GPIO3_A4: FPC5.6 ; also on sheet 1
GPIO3_A5: FPC5.7 ; also on sheet 1
GPIO3_B3: FPC5.8 ; also on sheet 1
GPIO3_B4: FPC5.9 ; also on sheet 1
GPIO3_B6: FPC5.13 ; also on sheet 1
GPIO3_D0: FPC5.18 ; also on sheet 1
GPIO3_D2: FPC5.24 ; also on sheet 1
GPIO3_D3: FPC5.23 ; also on sheet 1
GPIO3_D4: FPC5.22 ; also on sheet 1
GPIO3_D5: FPC5.17 ; also on sheet 1
GPIO4_C0: FPC5.15 ; also on sheet 1
GPIO4_C3: FPC5.14 ; also on sheet 1
GPIO4_C4: FPC5.36 ; also on sheet 1
GPIO4_D2: FPC5.16 ; also on sheet 1
HP_DET_L_GPIO3_A6: R126.1 ; also on sheet 1
HPL_OUT: C86.2 ; also on sheet 1
HPR_OUT: C87.2 ; also on sheet 1
I2C3_SCL_GPIO1_A1: FPC2.17 R207.2 ; also on sheet 1
I2C3_SDA_GPIO1_A0: FPC2.18 R208.2 ; also on sheet 1
I2C4_SCL_GPIO2_B2: FPC2.20 R209.2 ; also on sheet 1
I2C4_SDA_GPIO2_B1: FPC2.21 R210.2 ; also on sheet 1
MIC1_INN: C90.1 ; also on sheet 1
MIC1_INP: C89.1 ; also on sheet 1
PCIE30_REFCLKN_CON: R164.1 R167.1 R184.2
PCIE30_REFCLKN_IN: R161.1 R162.1 ; also on sheet 1
PCIE30_REFCLKP_CON: R165.1 R166.1 R183.2
PCIE30_REFCLKP_IN: R160.1 R163.1 ; also on sheet 1
PCIE30_RX0N: CN8.41 ; also on sheet 1
PCIE30_RX0P: CN8.43 ; also on sheet 1
PCIE30_RX1N: CN8.29 ; also on sheet 1
PCIE30_RX1P: CN8.31 ; also on sheet 1
PCIE30_TX0N: C127.2 ; also on sheet 1
PCIE30_TX0P: C126.2 ; also on sheet 1
PCIE30_TX1N: C129.2 ; also on sheet 1
PCIE30_TX1P: C128.2 ; also on sheet 1
PCIE30X2_CLKREQN_GPIO0_A6: R181.1 ; also on sheet 1
PCIE30X2_PRSTN_GPIO0_C6: R180.1 ; also on sheet 1
PCIE30X2_WAKEN_GPIO0_D5: R182.1 ; also on sheet 1
PCIE_PWREN_H_GPIO0_D4: R175.1 ; also on sheet 1
PCIECLKIC_OE_H_GPIO0_A4: R177.1 ; also on sheet 1
PHONE_DET: C86.1 CN3.6 R125.2 R126.2
PI6C_OE: Q8.3(C) R176.1 U41.6(OE)
PI6C_S0: R169.2 U41.1(S0)
PI6C_S1: R170.1 U41.2(S1)
PI6C_SS0: R171.2 R172.1 U41.3(SS0)
PI6C_SS1: R173.2 R174.1 U41.8(SS1)
PWM0_GPIO0_C7: FPC6.4 ; also on sheet 1
PWM1_GPIO0_C0: FPC6.5 ; also on sheet 1
PWM2_GPIO0_C1: FPC6.6 ; also on sheet 1
PWM3_IR_GPIO0_C2: C83.2 R114.1 ; also on sheet 1
PWM4_FAN_GPIO0_C3: Q9.2(S) R185.2 ; also on sheet 1
PWM6_GPIO0_C5: FPC6.7 ; also on sheet 1
PWM8_GPIO1_D5: FPC6.8 ; also on sheet 1
PWM9_GPIO1_D6: FPC6.9 ; also on sheet 1
PWM10_GPIO3_B5: FPC6.10 ; also on sheet 1
PWM14_GPIO4_C2: FPC6.11 ; also on sheet 1
RESETN: R123.2 ; also on sheet 1
RK809_PWRON: R122.2 ; also on sheet 1
RTC_I2C2_SCL_GPIO4_B5: R196.1 U28.6(SCL) ; also on sheet 1
RTC_I2C2_SDA_GPIO4_B4: R197.1 U28.5(SDA) ; also on sheet 1
SARADC_VIN0_KEY_RECOVERY: R120.2 R121.2 U32.2 ; also on sheet 1
SARADC_VIN1_HW_ID: R105.1 R106.2 ; also on sheet 1
SARADC_VIN2: FPC6.15 ; also on sheet 1
SARADC_VIN3_BOM_ID: R107.1 R108.2 ; also on sheet 1
SARADC_VIN4: FPC6.16 ; also on sheet 1
SARADC_VIN5: FPC6.17 ; also on sheet 1
SARADC_VIN6: FPC6.18 ; also on sheet 1
SARADC_VIN7: FPC6.19 ; also on sheet 1
SPI0_CLK_GPIO2_D3: FPC2.24 ; also on sheet 1
SPI0_CS0_GPIO2_D2: FPC2.23 ; also on sheet 1
SPI0_MISO_GPIO2_D0: FPC2.25 ; also on sheet 1
SPI0_MOSI_GPIO2_D1: FPC2.26 ; also on sheet 1
SPI1_CLK_GPIO3_C3: FPC2.29 ; also on sheet 1
SPI1_CS0_GPIO3_A1: FPC2.28 ; also on sheet 1
SPI1_MISO_GPIO3_C2: FPC2.30 ; also on sheet 1
SPI1_MOSI_GPIO3_C1: FPC2.31 ; also on sheet 1
SPI2_CLK_GPIO3_A0: FPC2.35 ; also on sheet 1
SPI2_CS0_GPIO2_D5: FPC2.33 ; also on sheet 1
SPI2_CS1_GPIO2_D4: FPC2.34 ; also on sheet 1
SPI2_MISO_GPIO2_D7: FPC2.36 ; also on sheet 1
SPI2_MOSI_GPIO2_D6: FPC2.37 ; also on sheet 1
SPKN_OUT: L9.1 ; also on sheet 1
SPKP_OUT: L10.1 ; also on sheet 1
UART2_RX_DEBUG_GPIO0_D0: U19.6(TXD) ; also on sheet 1
UART2_TX_DEBUG_GPIO0_D1: U19.7(RXD) ; also on sheet 1
UART3_RX_GPIO3_C0: R199.1 ; also on sheet 1
UART3_RX_PORT: FPC2.4 R199.2 U43.2
UART3_TX_GPIO3_B7: R200.1 ; also on sheet 1
UART3_TX_PORT: FPC2.5 R200.2 U44.2
UART4_RX_GPIO3_B1: R116.1 ; also on sheet 1
UART4_TX_GPIO3_B2: R117.1 ; also on sheet 1
UART5_CTS_PORT: FPC2.10 R202.2 U50.2
UART5_CTSN_GPIO1_D7: R202.1 ; also on sheet 1
UART5_RTS_PORT: FPC2.9 R201.2 U49.2
UART5_RTSN_GPIO2_A0: R201.1 ; also on sheet 1
UART5_RX_GPIO2_A1: R203.1 ; also on sheet 1
UART5_RX_PORT: FPC2.7 R203.2 U45.2
UART5_TX_GPIO2_A2: R204.1 ; also on sheet 1
UART5_TX_PORT: FPC2.8 R204.2 U46.2
UART7_RX_GPIO3_C5: R205.1 ; also on sheet 1
UART7_RX_PORT: FPC2.12 R205.2 U47.2
UART7_TX_GPIO3_C4: R206.1 ; also on sheet 1
UART7_TX_PORT: FPC2.13 R206.2 U48.2
UART9_RX_GPIO4_C6: R94.1 ; also on sheet 1
UART9_TX_GPIO4_C5: R95.1 ; also on sheet 1
UART_3V3: C73.1 C74.1 U19.5(VCC) U19.8(V3) U20.2(VOUT)
WORKING_LEDEN_H_GPIO0_B7: R104.2 ; also on sheet 1
Net-(B2-1): B2.1 D6.1(A)
Net-(BACK1-1): BACK1.1 R118.1
Net-(C82-2): C82.2 D5.2(K) D6.2(K) R196.2 R197.2 U28.8(VDD)
Net-(C84-2): C84.2 C85.2 IR2.3(VCC) R115.1
Net-(C87-1): C87.1 CN3.5 CN3.7
Net-(C88-1): C88.1 C90.2 C92.2 CN4.3 R128.2
Net-(C88-2): C88.2 C89.2 C91.2 CN4.4 CN4.5 CN4.6 CN4.7 R127.1
Net-(C110-1): C110.1 U40.6(BST)
Net-(C110-2): C110.2 L11.1 U40.2(SW)
Net-(C113-2): C113.2 R158.1 X2.1(OSC1)
Net-(C114-1): C114.1 U41.4(X1/CLK) X2.3(OSC2)
Net-(C115-2): C115.2 C116.2 R168.2 U41.12(VDDA)
Net-(C122-2): C122.2 R175.2 U42.3(EN)
Net-(C123-2): C123.2 U42.4(BP)
Net-(C126-1): C126.1 CN8.49
Net-(C127-1): C127.1 CN8.47
Net-(C128-1): C128.1 CN8.37
Net-(C129-1): C129.1 CN8.35
Net-(CN3-4): CN3.4 R124.1
Net-(CN8-38): CN8.38 R179.2
Net-(CN8-50): CN8.50 R180.2
Net-(CN8-52): CN8.52 R181.2
Net-(CN8-53): CN8.53 R184.1
Net-(CN8-54): CN8.54 R182.2
Net-(CN8-55): CN8.55 R183.1
Net-(CN9-1): CN9.1 Q9.3(D) R185.1
Net-(H4-1): H4.1 R94.2 U23.2
Net-(H4-2): H4.2 R95.2 U24.2
Net-(H5-1): H5.1 R116.2 U30.2
Net-(H5-2): H5.2 R117.2 U31.2
Net-(H6-1): H6.1 L9.2
Net-(H6-2): H6.2 L10.2
Net-(HOME1-1): HOME1.1 R118.2 R119.1
Net-(LED4-1): LED4.1(K) Q6.3
Net-(LED4-2): LED4.2(A) R102.1
Net-(PWRON1-1): PWRON1.1 R122.1 U33.2
Net-(Q6-1): Q6.1 R103.2 R104.1
Net-(Q8-1): Q8.1(B) R177.2 R178.1
Net-(R90-2): R90.2 R91.2 USB8.4(CC1) USB8.10(CC2)
Net-(R119-2): R119.2 R120.1 VOL-1.1
Net-(R121-1): R121.1 VOL+1.1
Net-(R123-1): R123.1 RESET1.1 U34.2
Net-(R154-2): R154.2 U40.5(EN)
Net-(R156-1): R156.1 R157.2 U40.4(FB)
Net-(R158-2): R158.2 U41.5(X2)
Net-(R159-2): R159.2 U41.9(IREF)
Net-(R160-2): R160.2 U41.11(CLK1)
Net-(R161-2): R161.2 U41.10(CLK1#)
Net-(R164-2): R164.2 U41.14(CLK0#)
Net-(R165-2): R165.2 U41.15(CLK0)

Not connected (* = marked no-connect by the designer): CN8 5* 6* 7* 8* 10* 11* 13* 17* 19* 20* 22* 23* 24* 25* 26* 28* 30* 32* 34* 36* 40* 42* 44* 46* 48* 56* 58* 67* 68* 69*; CN9 2* 5* 6*; U19 4(RTS#)*; U28 1(T1)* 2(T2)* 3(T3)* 7(T4)*; USB8 3(SBU2)* 9(SBU1)*

## Notes on the sheets
sheet 7
- DEBUG UART
- RTC IC
- IR RECEIVER
- SARADC ID
- WORKING LED
- FAN
- KEY
- AUDIO
sheet 8
- USER INTERFACE
- UART4
- UART9
sheet 9
- PCIE30X2 M.2
